# Altium schematic sheet DAC.SchDoc
size A; SheetNumber: 4; SheetTotal: 4
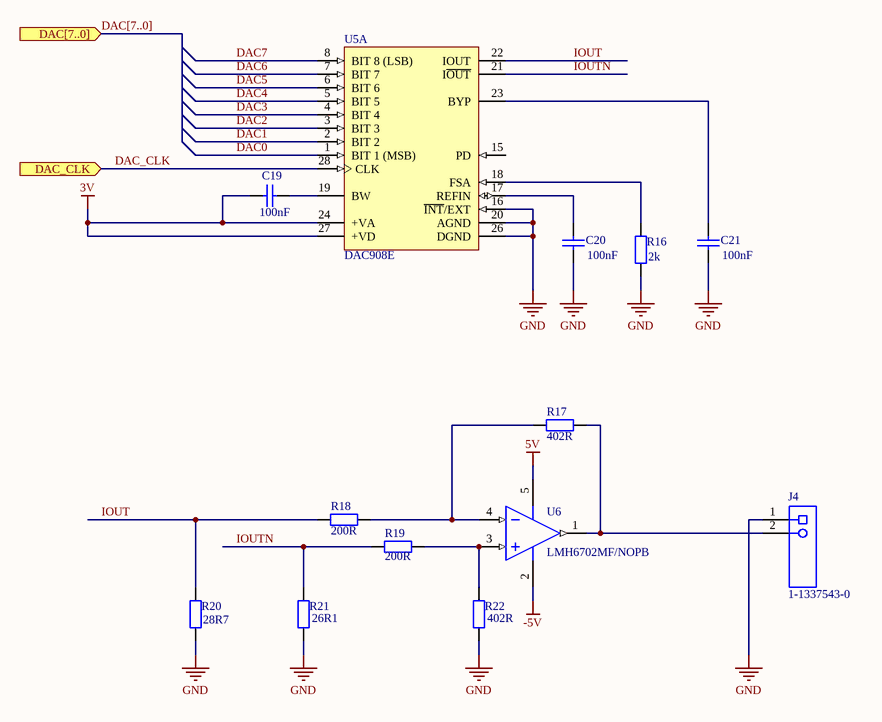
[diagram p0: DAC.SchDoc]

## Parts
C19  value 100nF  [RAD-0.3]  (hidden comment: Cap)
C20  value 100nF  [RAD-0.3]  (hidden comment: Cap)
C21  value 100nF  [RAD-0.3]  (hidden comment: Cap)
J4  1-1337543-0  [TECO-1-1337543-0_V]
R16  value 2k  [AXIAL-0.4]  (hidden comment: Res2)
R17  value 402R  [AXIAL-0.4]  (hidden comment: Res2)
R18  value 200R  [AXIAL-0.4]  (hidden comment: Res2)
R19  value 200R  [AXIAL-0.4]  (hidden comment: Res2)
R20  value 28R7  [AXIAL-0.4]  (hidden comment: Res2)
R21  value 26R1  [AXIAL-0.4]  (hidden comment: Res2)
R22  value 402R  [AXIAL-0.4]  (hidden comment: Res2)
U5  DAC908E  [TI-PW28_N]  (part A of 2)
U6  LMH6702MF/NOPB  [DBV0005A_N]

## Ports
DAC[7..0] (in), DAC_CLK (in)

## Nets
3V: C19.1 U5.24(+VA) U5.27(+VD)
5V: U6.5(V+)
-5V: U6.2(V-)
GND: C20.1 C21.1 J4.1 R16.1 R20.1 R21.1 R22.1 U5.16(~{INT}/EXT) U5.20(AGND) U5.26(DGND)
DAC0: U5.1(BIT_1_(MSB))
DAC1: U5.2(BIT_2)
DAC2: U5.3(BIT_3)
DAC3: U5.4(BIT_4)
DAC4: U5.5(BIT_5)
DAC5: U5.6(BIT_6)
DAC6: U5.7(BIT_7)
DAC7: U5.8(BIT_8_(LSB))
DAC_CLK: U5.28(CLK) ; port DAC_CLK
IOUT: R18.1 R20.2 U5.22(IOUT)
IOUTN: R19.1 R21.2 U5.21(I~{OUT})
NetC19_2: C19.2 U5.19(BW)
NetC20_2: C20.2 U5.17(REFIN)
NetC21_2: C21.2 U5.23(BYP)
NetJ4_2: J4.2 R17.1 U6.1(OUT)
NetR16_2: R16.2 U5.18(FSA)
NetR17_2: R17.2 R18.2 U6.4(IN-)
NetR19_2: R19.2 R22.2 U6.3(IN+)

Not connected (* = marked no-connect by the designer): U5 15(PD)

## Buses and harness runs
bus DAC[7..0] = port DAC[7..0]

## Library data of the parts
C19-C21 = Cap: Capacitor; Published: 8-Jun-2000; LatestRevisionDate: 17-Jul-2002; LatestRevisionNote: Re-released for DXP Platform.; PackageReference: RAD-0.3; Publisher: Altium Limited; PackageDescription: Radial Cap, Thru-Hole; 2 Leads; 0.3 in Pin Spacing
J4 = CMP-2000-05853-1: Female Connector, Pitch 2.54 mm, 1 x 2 Position, Height 15.8 mm, Tail Length 3.8 mm, / -55 to 85 degC, RoHS, Bulk; Manufacturer: TE Connectivity; Connector Body Style: RightAngleJack; Frequency Max: 4GHz; Coaxial Termination: Solder; Connector Mounting: PCBMount; SVHC: ToBeAdvised; Connector Type: BNCCoaxial; Impedance: 50ohm; Coaxial Cable Types: -; Manufacturer URL: http://www.te.com/; Package Reference: 1-1337543-0; Product Range: -; Datasheet URL: http://www.te.com/commerce/DocumentDelivery/DDEController?Action=showdoc&DocId=Customer+Drawing%7F1337543%7FG%7Fpdf%7FEnglish%7FENG_CD_1337543_G.pdf%7F1-1337543-0; Contact Plating: GoldPlatedContacts; Mounting Technology: ThroughHole; Package Description: Female Connector, Pitch 2.54 mm, 1 x 2 Position, Height 15.8 mm, Tail Length 3.8 mm; Contact Material: Brass; Datasheet Version: Rev. G, 12/2012
R16-R22 = Res2: Resistor; Published: 8-Jun-2000; LatestRevisionDate: 17-Jul-2002; LatestRevisionNote: Re-released for DXP Platform.; PackageReference: AXIAL-0.4; Publisher: Altium Limited; PackageDescription: Axial Device, Thru-Hole; 2 Leads; 0.4 in Pin Spacing
U5 = CMP-0004-01392-1: 8-Bit, 165 MSPS SpeedPlus(TM) DAC Scalable Current Outputs between 2 to 20 mA, -40 to 85 degC, 28-pin SOP (PW28), Green (RoHS & no Sb/Br); Manufacturer: Texas Instruments; Resolution(Bits): 8; SFDR(dB): 67; SubFamily: High Speed DAC (>10MSPS); DAC Channels: 1; Power Consumption(Typ)(mW): 170; Settling Time(us): 0.03; INL(Max)(+/-LSB): 0.5; Interface: Parallel CMOS; Mounting Technology: Surface Mount; ComponentLink2Description: Datasheet; ComponentLink3Description: Package Specification; ComponentLink1URL: http://www.ti.com/; Eco-Plan: Green (RoHS & no Sb/Br); PartNumber: DAC908E; DatasheetVersion: SBAS109B; PackageDescription: 28-Pin Plastic Small Outline, Body 9.7 x 4.4 mm, Pitch 0.65 mm; Code_JEDEC: MO-153; ComponentLink3URL: http://www.ti.com/litv/pdf/mpds364; PackageVersion: 4040064-7/G, 02/2011; ComponentLink2URL: http://www.ti.com/general/docs/lit/getliterature.tsp?genericPartNumber=DAC908&fileType=pdf; ComponentLink1Description: Manufacturer URL; PackageReference: PW28; DNL(Max)(+/-LSB): 0.5
U6 = CMP-0055-01272-3: 1.7 GHz, Ultra Low Distortion, Wideband Op Amp, 5-pin SOT-23, Pb-Free; Manufacturer: Texas Instruments; CompType: Amplifiers; PackageTopMarking: A83A*XTT; PowerWise: Y; Package Reference: DBV0005A; RoHS: Y; ComponentLink1Description: Datasheet URL; PackageDescription: Molded SOT-23, .115 x .063 x .040 in Body, 5 Lead, .0375 in Pitch; PinCount: 5; ComponentLink1URL: http://www.ti.com/general/docs/lit/getliterature.tsp?genericPartNumber=LMH6702&fileType=pdf